# EAGLE design main (EAGLE 7.1.0)

## Sheet 1 of 2: Main
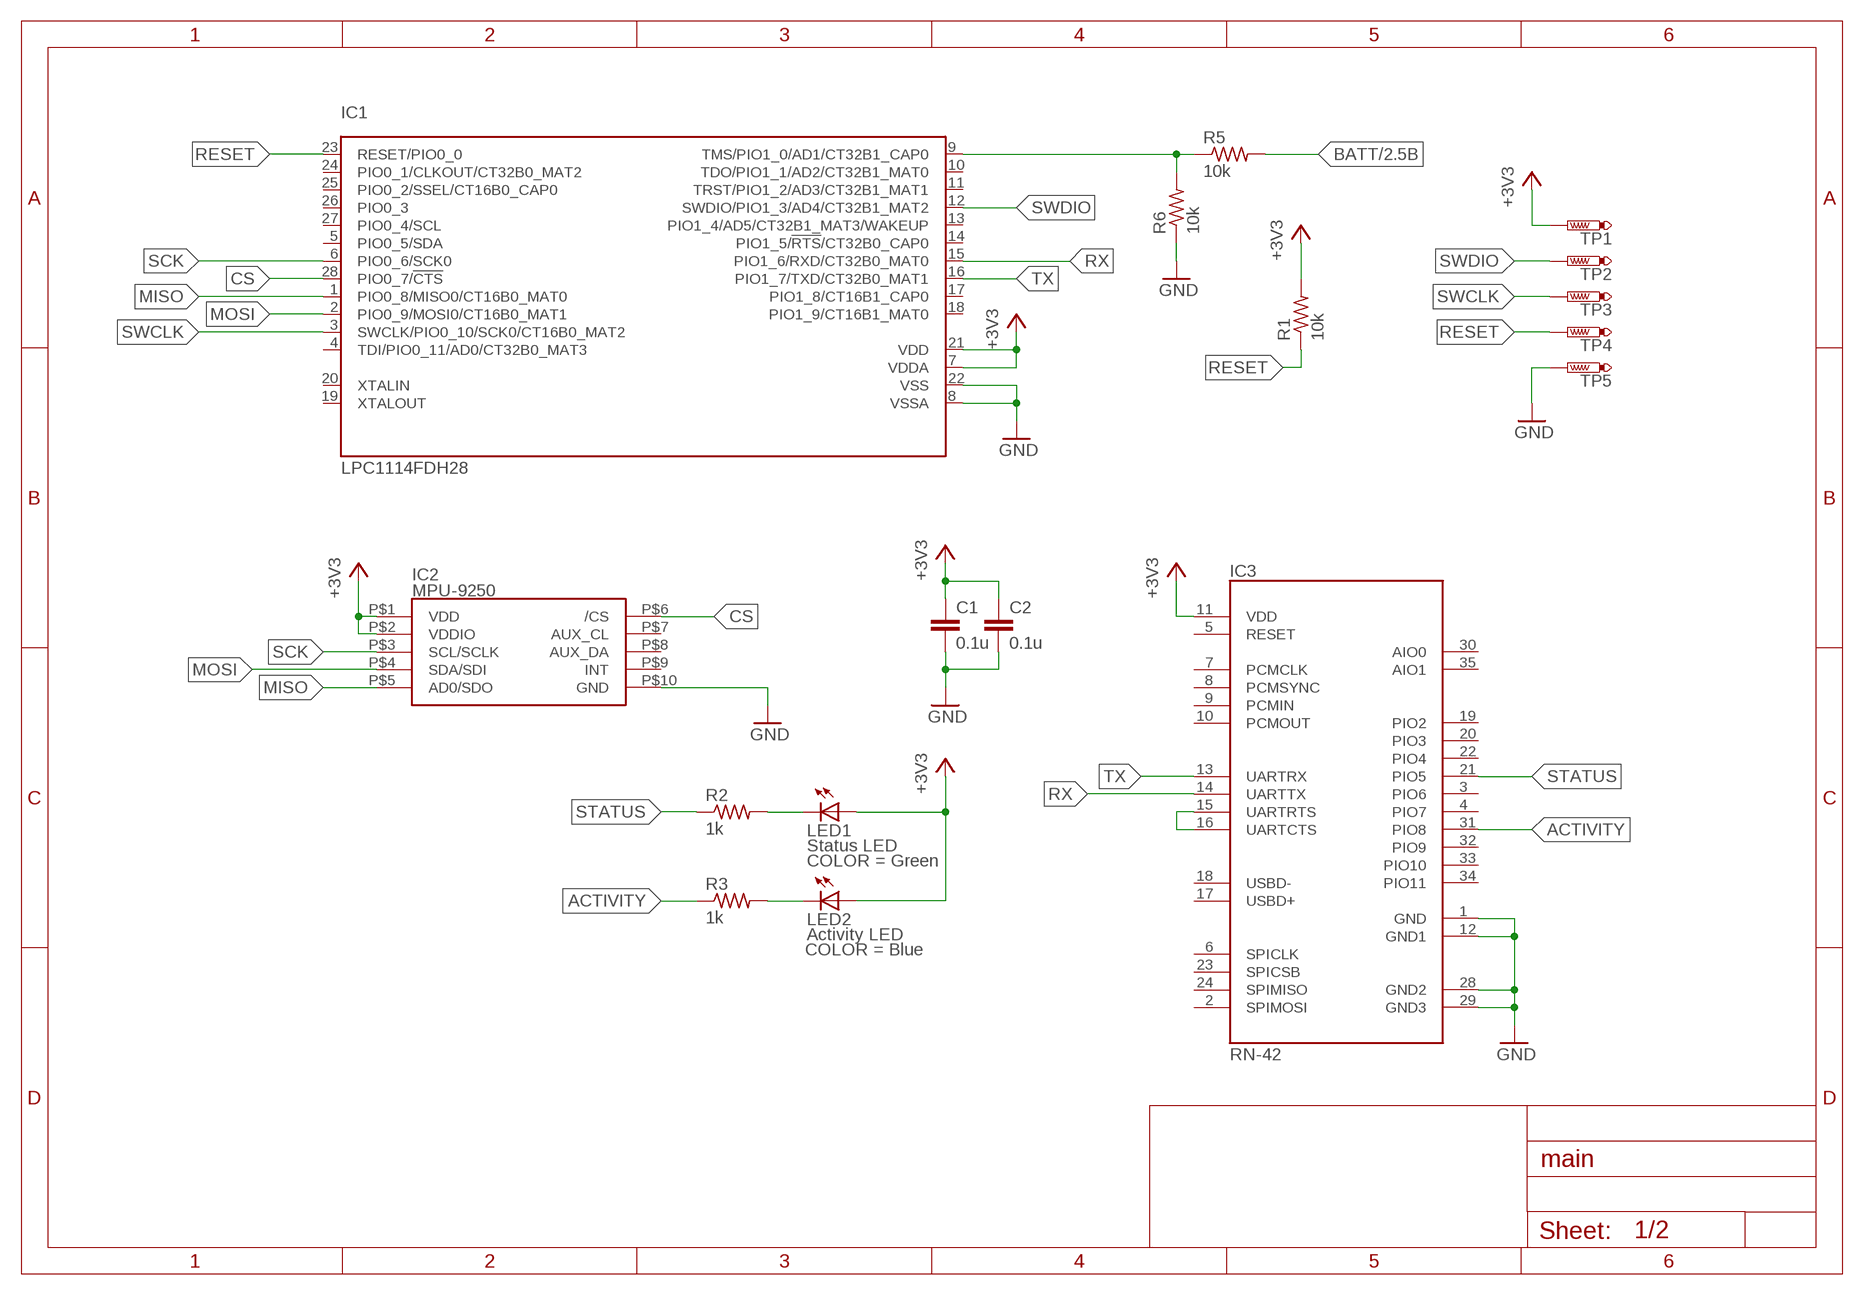
[diagram p0: schematic, sheet 1]

### Parts
C1  0.1u  C-EUC0603  [C0603]
C2  0.1u  C-EUC0603  [C0603]
IC1  LPC1114FDH28  [SOT361-1]
IC2  MPU-9250  [DIP10S]
IC3  RN-42  BLUETOOTH-RN41"  [RN41]
LED1  Status LED  LEDCHIP-LED0603  [CHIP-LED0603]
LED2  Activity LED  LEDCHIP-LED0603  [CHIP-LED0603]
R1  10k  R-US_R0603  [R0603]
R2  1k  R-US_R0603  [R0603]
R3  1k  R-US_R0603  [R0603]
R5  10k  R-US_R0603  [R0603]
R6  10k  R-US_R0603  [R0603]
TP1  3V3  PTR1B1,27  [B1,27]
TP2  SWDIO  PTR1B1,27  [B1,27]
TP3  SWCLK  PTR1B1,27  [B1,27]
TP4  RESET  PTR1B1,27  [B1,27]
TP5  GND  PTR1B1,27  [B1,27]

### Nets
+3V3: C1.1 C2.1 IC1.7(VDDA) IC1.21(VDD) IC2.P$1(VDD) IC2.P$2(VDDIO) IC3.11(VDD) LED1.A LED2.A R1.2 TP1.TP ; also sheet 2
ACTIVITY: IC3.31(PIO8) R3.1
BATT: R5.2 ; also sheet 2
CS: IC1.28(PIO0_7/!CTS!) IC2.P$6(/CS)
GND: C1.2 C2.2 IC1.8(VSSA) IC1.22(VSS) IC2.P$10(GND) IC3.1(GND) IC3.12(GND1) IC3.28(GND2) IC3.29(GND3) R6.1 TP5.TP ; also sheet 2
MISO: IC1.1(PIO0_8/MISO0/CT16B0_MAT0) IC2.P$5(AD0/SDO)
MOSI: IC1.2(PIO0_9/MOSI0/CT16B0_MAT1) IC2.P$4(SDA/SDI)
N$1: IC3.15(UARTRTS) IC3.16(UARTCTS)
N$3: LED1.C R2.2
N$4: LED2.C R3.2
N$8: IC1.9(TMS/PIO1_0/AD1/CT32B1_CAP0) R5.1 R6.2
RESET: IC1.23(RESET/PIO0_0) R1.1 TP4.TP
RX: IC1.15(PIO1_6/RXD/CT32B0_MAT0) IC3.14(UARTTX)
SCK: IC1.6(PIO0_6/SCK0) IC2.P$3(SCL/SCLK)
STATUS: IC3.21(PIO5) R2.1
SWCLK: IC1.3(SWCLK/PIO0_10/SCK0/CT16B0_MAT2) TP3.TP
SWDIO: IC1.12(SWDIO/PIO1_3/AD4/CT32B1_MAT2) TP2.TP
TX: IC1.16(PIO1_7/TXD/CT32B0_MAT1) IC3.13(UARTRX)
Unconnected: IC1.4(TDI/PIO0_11/AD0/CT32B0_MAT3) IC1.5(PIO0_5/SDA) IC1.10(TDO/PIO1_1/AD2/CT32B1_MAT0) IC1.11(TRST/PIO1_2/AD3/CT32B1_MAT1) IC1.13(PIO1_4/AD5/CT32B1_MAT3/WAKEUP) IC1.14(PIO1_5/!RTS!/CT32B0_CAP0) IC1.17(PIO1_8/CT16B1_CAP0) IC1.18(PIO1_9/CT16B1_MAT0) IC1.19(XTALOUT) IC1.20(XTALIN) IC1.24(PIO0_1/CLKOUT/CT32B0_MAT2) IC1.25(PIO0_2/SSEL/CT16B0_CAP0) IC1.26(PIO0_3) IC1.27(PIO0_4/SCL) IC2.P$7(AUX_CL) IC2.P$8(AUX_DA) IC2.P$9(INT) IC3.2(SPIMOSI) IC3.3(PIO6) IC3.4(PIO7) IC3.5(RESET) IC3.6(SPICLK) IC3.7(PCMCLK) IC3.8(PCMSYNC) IC3.9(PCMIN) IC3.10(PCMOUT) IC3.17(USBD+) IC3.18(USBD-) IC3.19(PIO2) IC3.20(PIO3) IC3.22(PIO4) IC3.23(SPICSB) IC3.24(SPIMISO) IC3.30(AIO0) IC3.32(PIO9) IC3.33(PIO10) IC3.34(PIO11) IC3.35(AIO1)

## Sheet 2 of 2: Power
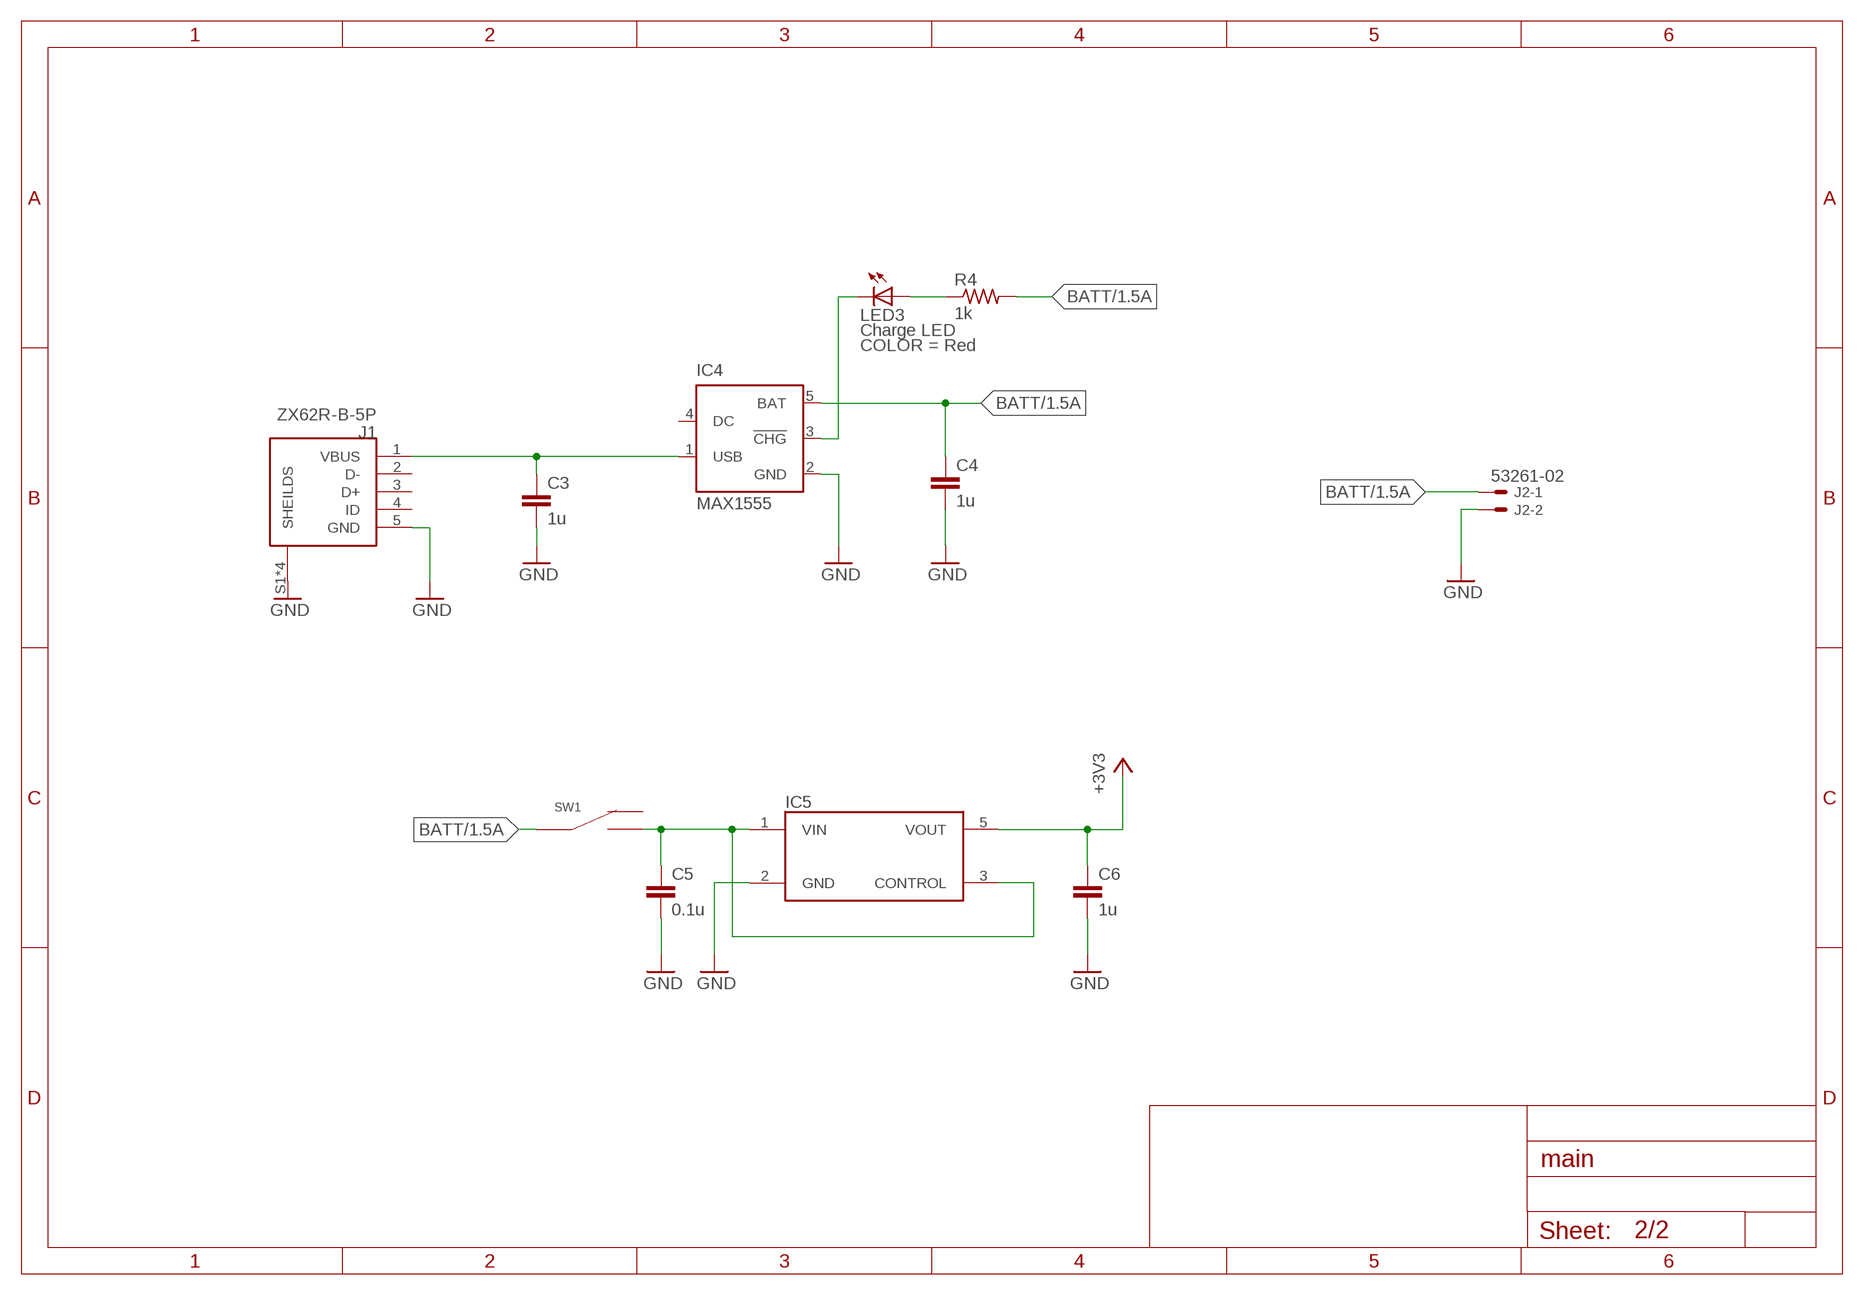
[diagram p1: schematic, sheet 2]

### Parts
C3  1u  C-EUC0603  [C0603]
C4  1u  C-EUC0603  [C0603]
C5  0.1u  C-EUC0603  [C0603]
C6  1u  C-EUC0603  [C0603]
IC4  MAX1555  [SOT23-5L]
IC5  NJM2866F33  [SOT23-5L]
J1  ZX62R-B-5P  [ZX62R-B-5P]
J2  53261-02  [53261-02]
LED3  Charge LED  LEDCHIP-LED0603  [CHIP-LED0603]
R4  1k  R-US_R0603  [R0603]
SW1  SK-12D01-VG4  [SK-12D01-VG4]

### Nets
+3V3: C6.1 IC5.5(VOUT) ; also sheet 1
BATT: C4.1 IC4.5(BAT) J2.1 R4.2 SW1.P$2 ; also sheet 1
GND: C3.2 C4.2 C5.2 C6.2 IC4.2(GND) IC5.2(GND) J1.5(GND) J1.S1(SHEILDS) J1.S2(SHEILDS) J1.S3(SHEILDS) J1.S4(SHEILDS) J2.2 ; also sheet 1
N$2: C3.1 IC4.1(USB) J1.1(VBUS)
N$5: IC4.3(!CHG) LED3.C
N$6: LED3.A R4.1
N$7: C5.1 IC5.1(VIN) IC5.3(CONTROL) SW1.P$3
Unconnected: IC4.4(DC) J1.2(D-) J1.3(D+) J1.4(ID) SW1.P$1

## Library data of the parts
C1-C6 = rcl:C-EU: CAPACITOR, European symbol
IC1 = nxp_60:LPC1114FDH28: LPC1114 50 MHz 32-bit ARM Cortex-M0 based microcontroller featuring a high level of integration and very low power consumption. On-chip flash program memory The LPC1110/11/12/13/14 contain 32 kB (LPC1114), 24 kB (LPC1113), 16 kB (LPC1112), 8 kB (LPC1111),or 4 kB (LPC1110) of on-chip flash memory. On-chip SRAM The LPC1110/11/12/13/14 contain a total of 8 kB, 4 kB, 2 kB, or 1 kB on-chip static RAM memory. MK - Datasheet available on www.nxp.com; MF: NXP Semiconductors; MPN: LPC1114FDH28/102; OC: I-10224; SITE: Akizukidenshi
IC2 = Library:MPU-9250; MF: InverSense; MPN: MPU-9250; OC: 12250; SITE: StrawberryLinux
IC3 = SparkFun-RF:BLUETOOTH-RN41: Bluetooth SMD module; MF: Microchip; MPN: RN-42-I/RM; OC: M-07612; SITE: Akizukidenshi
IC4 = maxim:MAX1555: Dual-Input USB/AC Adapter 1-Cell Li+ Battery Chargers Source: http://www.maxim-ic.com .. MAX1551-MAX1555.pdf; MF: MAXIM; MPN: MAX1555EZK+T; OC_FARNELL: 1628222; OC_NEWARK: 59J2761
IC5 = Library:NJM2866F33; MF: NewJRC; MPN: NJM2866F33; OC: I-05448; SITE: Akizukidenshi
J1 = Library:ZX62R-B-5P; MF: Hirose; MPN: ZX62R-B-5P; OC: C-05254; SITE: Akizukidenshi
J2 = con-molex:53?-02: CONNECTOR wire to board 1.25 mm (.049 inch) pitch header; MF: Molex; MPN: 53261-0271; OC: 542-7090; OC_FARNELL: 1125373; OC_NEWARK: unknown; SITE: RS Components
LED1 = led:LED: LED OSRAM: - CHIPLED LG R971, LG N971, LY N971, LG Q971, LY Q971, LO R971, LY R971 LH N974, LH R974 LS Q976, LO Q976, LY Q976 LO Q996 - Hyper CHIPLED LW Q18S LB Q993, LB Q99A, LB R99A - SideLED LS A670, LO A670, LY A670, LG A670, LP A670 LB A673, LV A673, LT A673, LW A673 LH A674 LY A675 LS A676, LA A676, LO A676, LY A676, LW A676 LS A679, LY A679, LG A679 - Hyper Micro SIDELED® LS Y876, LA Y876, LO Y876, LY Y876 LT Y87S - SmartLED LW L88C, LW L88S LB L89C, LB L89S, LG L890 LS L89K, LO L89K, LY L89K LS L896, LA L896, LO L896, LY L896 - TOPLED LS T670, LO T670, LY T670, LG T670, LP T670 LSG T670, LSP T670, LSY T670, LOP T670, LYG T670 LG T671, LOG T671, LSG T671 LB T673, LV T673, LT T673, LW T673 LH T674 LS T676, LA T676, LO T676, LY T676, LB T676, LH T676, LSB T676, LW T676 LB T67C, LV T67C, LT T67C, LS T67K, LO T67K, LY T67K, LW E67C LS E67B, LA E67B, LO E67B, LY E67B, LB E67C, LV E67C, LT E67C LW T67C LS T679, LY T679, LG T679 LS T770, LO T770, LY T770, LG T770, LP T770 LB T773, LV T773, LT T773, LW T773 LH T774 LS E675, LA E675, LY E675, LS T675 LS T776, LA T776, LO T776, LY T776, LB T776 LHGB T686 LT T68C, LB T68C - Hyper Mini TOPLED® LB M676 - Mini TOPLED Santana® LG M470 LS M47K, LO M47K, LY M47K Source: http://www.osram.convergy.de LUXEON: - LUMILED® LXK2-PW12-R00, LXK2-PW12-S00, LXK2-PW14-U00, LXK2-PW14-V00 LXK2-PM12-R00, LXK2-PM12-S00, LXK2-PM14-U00 LXK2-PE12-Q00, LXK2-PE12-R00, LXK2-PE12-S00, LXK2-PE14-T00, LXK2-PE14-U00 LXK2-PB12-K00, LXK2-PB12-L00, LXK2-PB12-M00, LXK2-PB14-N00, LXK2-PB14-P00, LXK2-PB14-Q00 LXK2-PR12-L00, LXK2-PR12-M00, LXK2-PR14-Q00, LXK2-PR14-R00 LXK2-PD12-Q00, LXK2-PD12-R00, LXK2-PD12-S00 LXK2-PH12-R00, LXK2-PH12-S00 LXK2-PL12-P00, LXK2-PL12-Q00, LXK2-PL12-R00 Source: www.luxeon.com KINGBRIGHT: KA-3528ASYC Source: www.kingbright.com; COLOR: Green; MF: OptoSupply; MPN: OSYG1608C1A; OC: I-03980; SITE: Akizukidenshi
LED2 = led:LED: LED OSRAM: - CHIPLED LG R971, LG N971, LY N971, LG Q971, LY Q971, LO R971, LY R971 LH N974, LH R974 LS Q976, LO Q976, LY Q976 LO Q996 - Hyper CHIPLED LW Q18S LB Q993, LB Q99A, LB R99A - SideLED LS A670, LO A670, LY A670, LG A670, LP A670 LB A673, LV A673, LT A673, LW A673 LH A674 LY A675 LS A676, LA A676, LO A676, LY A676, LW A676 LS A679, LY A679, LG A679 - Hyper Micro SIDELED® LS Y876, LA Y876, LO Y876, LY Y876 LT Y87S - SmartLED LW L88C, LW L88S LB L89C, LB L89S, LG L890 LS L89K, LO L89K, LY L89K LS L896, LA L896, LO L896, LY L896 - TOPLED LS T670, LO T670, LY T670, LG T670, LP T670 LSG T670, LSP T670, LSY T670, LOP T670, LYG T670 LG T671, LOG T671, LSG T671 LB T673, LV T673, LT T673, LW T673 LH T674 LS T676, LA T676, LO T676, LY T676, LB T676, LH T676, LSB T676, LW T676 LB T67C, LV T67C, LT T67C, LS T67K, LO T67K, LY T67K, LW E67C LS E67B, LA E67B, LO E67B, LY E67B, LB E67C, LV E67C, LT E67C LW T67C LS T679, LY T679, LG T679 LS T770, LO T770, LY T770, LG T770, LP T770 LB T773, LV T773, LT T773, LW T773 LH T774 LS E675, LA E675, LY E675, LS T675 LS T776, LA T776, LO T776, LY T776, LB T776 LHGB T686 LT T68C, LB T68C - Hyper Mini TOPLED® LB M676 - Mini TOPLED Santana® LG M470 LS M47K, LO M47K, LY M47K Source: http://www.osram.convergy.de LUXEON: - LUMILED® LXK2-PW12-R00, LXK2-PW12-S00, LXK2-PW14-U00, LXK2-PW14-V00 LXK2-PM12-R00, LXK2-PM12-S00, LXK2-PM14-U00 LXK2-PE12-Q00, LXK2-PE12-R00, LXK2-PE12-S00, LXK2-PE14-T00, LXK2-PE14-U00 LXK2-PB12-K00, LXK2-PB12-L00, LXK2-PB12-M00, LXK2-PB14-N00, LXK2-PB14-P00, LXK2-PB14-Q00 LXK2-PR12-L00, LXK2-PR12-M00, LXK2-PR14-Q00, LXK2-PR14-R00 LXK2-PD12-Q00, LXK2-PD12-R00, LXK2-PD12-S00 LXK2-PH12-R00, LXK2-PH12-S00 LXK2-PL12-P00, LXK2-PL12-Q00, LXK2-PL12-R00 Source: www.luxeon.com KINGBRIGHT: KA-3528ASYC Source: www.kingbright.com; COLOR: Blue; MF: OptoSupply; MPN: OSBL1608C1A; OC: I-03982; SITE: Akizukidenshi
LED3 = led:LED: LED OSRAM: - CHIPLED LG R971, LG N971, LY N971, LG Q971, LY Q971, LO R971, LY R971 LH N974, LH R974 LS Q976, LO Q976, LY Q976 LO Q996 - Hyper CHIPLED LW Q18S LB Q993, LB Q99A, LB R99A - SideLED LS A670, LO A670, LY A670, LG A670, LP A670 LB A673, LV A673, LT A673, LW A673 LH A674 LY A675 LS A676, LA A676, LO A676, LY A676, LW A676 LS A679, LY A679, LG A679 - Hyper Micro SIDELED® LS Y876, LA Y876, LO Y876, LY Y876 LT Y87S - SmartLED LW L88C, LW L88S LB L89C, LB L89S, LG L890 LS L89K, LO L89K, LY L89K LS L896, LA L896, LO L896, LY L896 - TOPLED LS T670, LO T670, LY T670, LG T670, LP T670 LSG T670, LSP T670, LSY T670, LOP T670, LYG T670 LG T671, LOG T671, LSG T671 LB T673, LV T673, LT T673, LW T673 LH T674 LS T676, LA T676, LO T676, LY T676, LB T676, LH T676, LSB T676, LW T676 LB T67C, LV T67C, LT T67C, LS T67K, LO T67K, LY T67K, LW E67C LS E67B, LA E67B, LO E67B, LY E67B, LB E67C, LV E67C, LT E67C LW T67C LS T679, LY T679, LG T679 LS T770, LO T770, LY T770, LG T770, LP T770 LB T773, LV T773, LT T773, LW T773 LH T774 LS E675, LA E675, LY E675, LS T675 LS T776, LA T776, LO T776, LY T776, LB T776 LHGB T686 LT T68C, LB T68C - Hyper Mini TOPLED® LB M676 - Mini TOPLED Santana® LG M470 LS M47K, LO M47K, LY M47K Source: http://www.osram.convergy.de LUXEON: - LUMILED® LXK2-PW12-R00, LXK2-PW12-S00, LXK2-PW14-U00, LXK2-PW14-V00 LXK2-PM12-R00, LXK2-PM12-S00, LXK2-PM14-U00 LXK2-PE12-Q00, LXK2-PE12-R00, LXK2-PE12-S00, LXK2-PE14-T00, LXK2-PE14-U00 LXK2-PB12-K00, LXK2-PB12-L00, LXK2-PB12-M00, LXK2-PB14-N00, LXK2-PB14-P00, LXK2-PB14-Q00 LXK2-PR12-L00, LXK2-PR12-M00, LXK2-PR14-Q00, LXK2-PR14-R00 LXK2-PD12-Q00, LXK2-PD12-R00, LXK2-PD12-S00 LXK2-PH12-R00, LXK2-PH12-S00 LXK2-PL12-P00, LXK2-PL12-Q00, LXK2-PL12-R00 Source: www.luxeon.com KINGBRIGHT: KA-3528ASYC Source: www.kingbright.com; COLOR: Red; MF: OptoSupply; MPN: OSHR1608C1A; OC: I-03978; SITE: Akizukidenshi
R1-R6 = rcl:R-US_: RESISTOR, American symbol
SW1 = Library:SK-12D01-VG4; MF: Zhejiang Jianfu; MPN: SK-12D01-VG4; OC: P-08789; SITE: Akizukidenshi
TP1-TP5 = testpad:PTR1: TEST PIN

## Net classes
0 default: width 0.254 mm

## Board
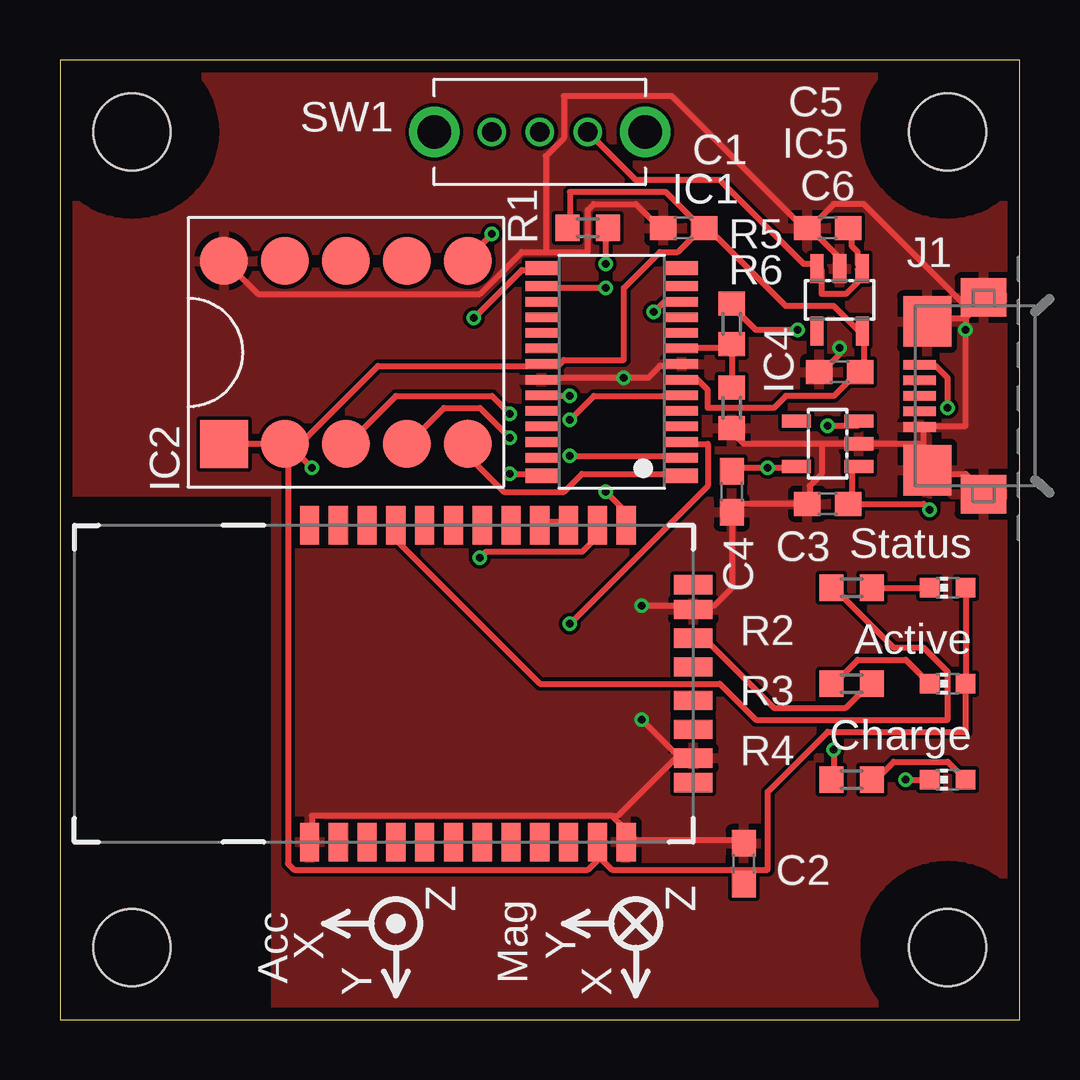
[diagram p2: board, top side]
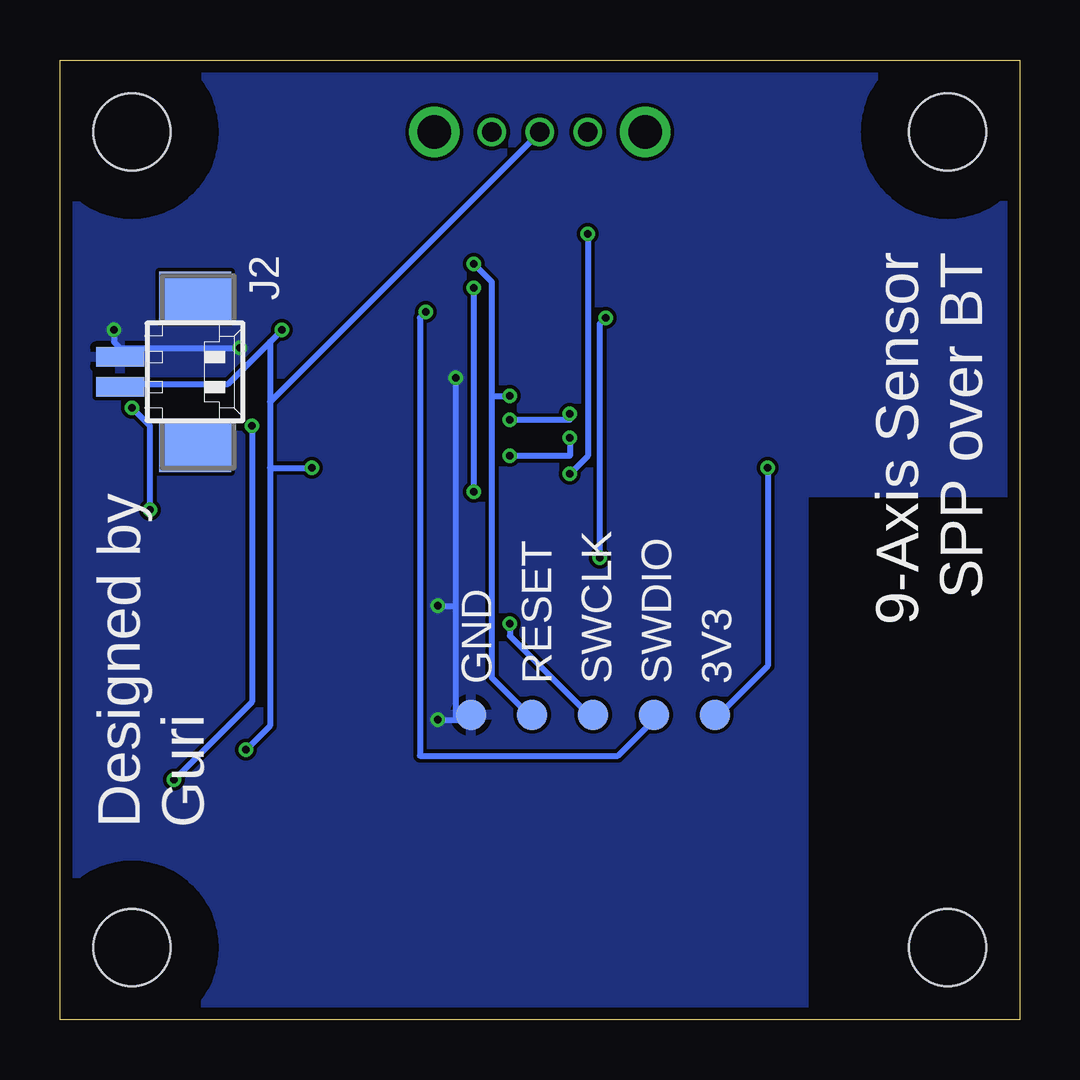
[diagram p3: board, bottom side, seen from below]

Size 40 x 40 mm. Coordinates in mm from the lower left corner, seen from the top.
Outline: 0,0 40,0 40,40 0,40 0,0
Copper layers (1*16): Top 0.035mm / dielectric 1.6mm / Bottom 0.035mm
Design rules "Elecrow_2-layer_PCB_eagle_rule": minimum track width 6mil, minimum drill 12mil, track to track 6mil, track to pad 6mil, pad to pad 6mil, via to via 8mil, smd to smd 0mil, copper to edge 20mil, drill to drill 10mil, minimum pad ring 6mil, minimum via ring 6mil, stop-mask expansion 0mil, vias tented up to drill 100mil, thermal gap 10mil
Holes 3.2 mm at 3,37 37,37 37,3 3,3
tRestrict: area -0.5,33.5 to 6.5,40.5; area 33.5,-0.5 to 40.5,6.5; area 33.5,33.5 to 40.5,40.5; area -0.5,-0.5 to 6.5,6.5
bRestrict: area 33.5,33.5 to 40.5,40.5; area -0.5,-0.5 to 6.5,6.5; area -0.5,33.5 to 6.5,40.5; area 33.5,-0.5 to 40.5,6.5

### Footprints (pad centres in the part's own frame; a part is rotated, then mirrored left to right if it is on the bottom)
C0603 = smd 1.1 x 1: 1 -0.85,0; 2 0.85,0
SOT361-1 = smd 0.6 x 1.35: 1 -4.325,-2.925; 14 4.325,-2.925; 15 4.325,2.925; 28 -4.325,2.925 | smd 0.4 x 1.35: 2 -3.575,-2.925; 3 -2.925,-2.925; 4 -2.275,-2.925; 5 -1.625,-2.925; 6 -0.975,-2.925; 7 -0.325,-2.925; 8 0.325,-2.925; 9 0.975,-2.925; 10 1.625,-2.925; 11 2.275,-2.925; 12 2.925,-2.925; 13 3.575,-2.925; 16 3.575,2.925; 17 2.925,2.925; 18 2.275,2.925; 19 1.625,2.925; 20 0.975,2.925; 21 0.325,2.925; 22 -0.325,2.925; 23 -0.975,2.925; 24 -1.625,2.925; 25 -2.275,2.925; 26 -2.925,2.925; 27 -3.575,2.925
DIP10S = smd 2 x 2: P$1 0,10.16; P$2 0,7.62; P$3 0,5.08; P$4 0,2.54; P$5 0,0; P$6 7.62,0; P$7 7.62,2.54; P$8 7.62,5.08; P$9 7.62,7.62; P$10 7.62,10.16
RN41 = smd 0.8 x 1.6: 1 -6.6,-6.6; 2 -5.4,-6.6; 3 -4.2,-6.6; 4 -3,-6.6; 5 -1.8,-6.6; 6 -0.6,-6.6; 7 0.6,-6.6; 8 1.8,-6.6; 9 3,-6.6; 10 4.2,-6.6; 11 5.4,-6.6; 12 6.6,-6.6; 13 6.6,6.6; 14 5.4,6.6; 15 4.2,6.6; 16 3,6.6; 17 1.8,6.6; 18 0.6,6.6; 19 -0.6,6.6; 20 -1.8,6.6; 21 -3,6.6; 22 -4.2,6.6; 23 -5.4,6.6; 24 -6.6,6.6 | smd 1.6 x 0.8: 28 9.4,3.1; 29 9.4,-3.1; 30 9.4,4.122; 31 9.4,1.9; 32 9.4,0.7; 33 9.4,-0.7; 34 9.4,-1.9; 35 9.4,-4.122
SOT23-5L = smd 0.55 x 1.2: 1 -0.95,-1.3; 2 0,-1.3; 3 0.95,-1.3; 4 0.95,1.3; 5 -0.95,1.3
ZX62R-B-5P = smd 0.4 x 1.35: 1 1.3,2.675; 2 0.65,2.675; 3 0,2.675; 4 -0.65,2.675; 5 -1.3,2.675 | smd 1.6 x 1.9: S1 4.1,0; S2 -4.1,0 | smd 2.1 x 2: S3 3.1,2.35; S4 -3.1,2.35
53261-02 = smd 0.8 x 2: 1 0.625,-2.5; 2 -0.625,-2.5 | smd 2.1 x 3: S1 3.125,0.625; S2 -3.125,0.625
CHIP-LED0603 = smd 0.8 x 0.8: A 0,-0.75; C 0,0.75
R0603 = smd 1 x 1.1: 1 -0.85,0; 2 0.85,0
SK-12D01-VG4 = drill 0.8: P$1 0,0; P$2 2,0; P$3 4,0 | drill 1.4: P$4 -2.4,0; P$5 6.4,0
B1,27 = smd 1.27 x 1.27: TP 0,0

### Placement (x,y rotation side)
C1  26,33 180 top
C2  28.5,6.5 90 top
C3  32,21.5 180 top
C4  28,22 270 top
C5  32,33 180 top
C6  32.5,27 180 top
IC1  23,27 90 top
IC2  17,24 90 top
IC3  17,14 0 top
IC4  32,24 90 top
IC5  32.5,30 180 top
J1  38.5,26 90 top
J2  35,27 270 bottom
LED1  37,18 90 top
LED2  37,14 90 top
LED3  37,10 90 top
R1  22,33 180 top
R2  33,18 0 top
R3  33,14 180 top
R4  33,10 180 top
R5  28,29 90 top
R6  28,25.5 90 top
SW1  18,37 0 top
TP1  12.7,12.7 0 bottom
TP2  15.24,12.7 0 bottom
TP3  17.78,12.7 0 bottom
TP4  20.32,12.7 0 bottom
TP5  22.86,12.7 0 bottom

### Tracks (layer width: path | path; a pad name or v marks a point on that pad's centre or on a via)
+3V3  (via drill 0.3)
  Top 0.254: LED1.A LED2.A 37.75,12 32,12 29.5,9.5 29.5,6.25 28,6.25 | 28,6.25 28.5,5.75 C2.1 | 28,6.25 23,6.25 22.5,6.75 | 22.5,6.75 22.5,7.25 IC3.11 22.5,6.75 | 26.75,33 25.25,34.5 21.25,34.5 21.25,33 R1.2 | IC1.7 26,26.75 26.5,26.75 27,26.25 27,25.5 29.75,25.5 30.25,26 32.25,26 33.25,27 C6.1 33.5,27 33.5,28.5 IC5.5 33.25,28.75 32.25,29.75 30.25,29.75 27,33 C1.1 26.75,33 | 9.5,24 9.75,23.75 | 9.75,23.75 v10.5,23 | 9.75,23.75 13.25,27.25 20,27.25 IC1.21 20.25,27.25 20.75,27.25 21,27.5 23.5,27.5 23.5,30.5 25,32 25.75,32 26.75,33 | 9.75,23.75 IC2.P$2 | IC2.P$2 IC2.P$1 | 22.5,6.75 22,6.25 9.75,6.25 9.5,6.5 9.5,24 | 9.5,24 IC2.P$2
  Bottom 0.254: v10.5,23 10.5,14.75 12.5,12.75 TP1.TP
ACTIVITY
  Top 0.254: R3.1 33.75,14 32.75,13 29.75,13 27,15.75 26.5,15.75 IC3.31
BATT  (via drill 0.3)
  Top 0.254: C4.1 28,23 v29.5,23 30.5,23 IC4.5 | v30.75,28.75 29,28.75 28,29.75 R5.2 | v32.25,11.25 32.25,10 R4.2
  Bottom 0.254: 31.25,28.25 33,26.5 37.5,26.5 J2.1 | 31.25,28.25 v30.75,28.75 | v32.25,11.25 31.25,12.25 31.25,23 | 31.25,28.25 31.25,25.75 | 31.25,25.75 31.25,23 | 31.25,23 v29.5,23 | 31.25,25.75 SW1.P$2
CS  (via drill 0.3)
  Top 0.254: v18.75,22.75 20,22.75 IC1.28 | v18,32.75 17,31.75 IC2.P$6
  Bottom 0.254: v18.75,22.75 18,23.5 v18,32.75
GND  (via drill 0.3)
  Top 0.254: IC1.22 20.25,26.75 v23.5,26.75 24.5,26.75 25,27.25 25.75,27.25 IC1.8 | 25.75,11 v24.25,12.5 | 25.75,11 26.25,11 IC3.29 25.75,11 | 24,7.5 23.75,7.5 IC3.12 | 24,7.5 28.5,7.5 C2.2 | 23,8.5 10.5,8.5 10.5,7.5 IC3.1 | 24,7.5 23,8.5 | 25.75,11 23.25,8.5 23,8.5 | 20.25,32 19.25,32 17.5,30.25 8.25,30.25 7,31.5 IC2.P$10 | 20.25,32 22,32 22,33.75 22.25,34 24,34 25,33 C1.2 | v32.5,28 32.5,27.75 31.75,27 C6.2 | 31.25,33 32.5,31.75 IC5.2 | 37.75,29.25 38,29.5 | 38,29.5 38.5,30 J1.S1 38,29.5 | 37.75,29.25 36.25,29.25 J1.S3 | 31.25,33 32.25,34 33.5,34 38,29.5 | 31.25,33 C5.2 31,33 25.5,38.5 21,38.5 21,36.75 20.25,36 20.25,32 | 37.75,29.25 v37.75,28.75 37.75,24.75 36,24.75 | 31.75,24 IC4.2 36,24 | 31.75,24 28.5,24 28,24.5 R6.1 | 36,24 36,23 J1.S4 36.25,22.75 37.75,22.75 38.5,22 J1.S2 | 36,24 36,24.75 | 31.75,24 31.75,22.75 31.25,22.25 31.25,21.5 C3.2 28.25,21.5 28,21.25 C4.2 28,18 27.25,17.25 26.5,17.25 IC3.28 26.25,17.25 v24.25,17.25 | 36,24.75 J1.5
  Bottom 0.254: v24.25,12.5 23.5,12.5 | 23.5,12.5 23,12.5 TP5.TP | 23.5,12.5 23.5,17.25 | 23.5,17.25 v23.5,26.75 | 37.5,28 v32.5,28 | 37.5,28 37.75,28.25 v37.75,28.75 | 37.5,28 J2.2 | v24.25,17.25 23.5,17.25
  pour Top: -3,43 43,43 43,-3 9,-3 9,22 -3,22
  pour Bottom: -2,42 42,42 42,-2 9,-2 9,22 -2,22
MISO
  Top 0.254: IC2.P$5 17,23.5 18.5,22 21,22 21.75,22.75 25.75,22.75 IC1.1
MOSI  (via drill 0.3)
  Top 0.254: v21.25,23.5 25.75,23.5 IC1.2 | v18.75,24.25 17.5,25.5 16,25.5 14.5,24 IC2.P$4
  Bottom 0.254: v21.25,23.5 18.75,23.5 v18.75,24.25
N$1
  Top 0.254: IC3.16 20,20.75 21,20.75 IC3.15
N$2  (via drill 0.3)
  Top 0.254: 33,21.5 33,23 33.25,23 IC4.1 | v37,25.5 37,26.75 36.5,27.25 36,27.25 J1.1 | v36.25,21.25 36,21.5 33,21.5 | 33,21.5 C3.1
  Bottom 0.254: v37,25.5 36.25,24.75 v36.25,21.25
N$3
  Top 0.254: R2.2 LED1.C
N$4
  Top 0.254: LED2.C 35.25,15 33.25,15 32.25,14 R3.2
N$5  (via drill 0.3)
  Top 0.254: v35.25,10 LED3.C | v32,24.75 33.25,24.75 IC4.3
  Bottom 0.254: v35.25,10 32,13.25 v32,24.75
N$6
  Top 0.254: LED3.A 37,10.75 34.75,10.75 34,10 R4.1
N$7
  Top 0.254: C5.1 33,33 33,32.25 33.25,32 33.25,31.5 IC5.1 33.25,31.25 33.25,30.75 32.75,30.25 31.75,30.25 31.75,31.25 IC5.3 31.5,31.5 31,31.5 27.5,35 24,35 SW1.P$3
N$8
  Top 0.254: 28,28 R6.2 | 28,28 26,28 IC1.9 | 28,28 R5.1
RESET  (via drill 0.3)
  Top 0.254: v22.75,31.5 22.75,33 R1.1 | v21.25,26 20.25,26 IC1.23
  Bottom 0.254: v22.75,31.5 22,30.75 22,26 | 22,26 22,14.25 20.5,12.75 TP4.TP | 22,26 v21.25,26
RX  (via drill 0.3)
  Top 0.254: v17.25,29.25 19.25,31.25 20,31.25 IC1.15 | v17.5,19.25 17.75,19.5 21.75,19.5 22.25,20 22.25,20.5 IC3.14
  Bottom 0.254: v17.25,29.25 17.5,29 v17.5,19.25
SCK  (via drill 0.3)
  Top 0.254: v21.25,25 22.25,26 25.75,26 IC1.6 | v18.75,25.25 18,26 14,26 12,24 IC2.P$3
  Bottom 0.254: v21.25,25 18.75,25 v18.75,25.25
STATUS
  Top 0.254: IC3.21 14,20 20,14 27.5,14 29,12.5 37,12.5 37,14.5 36,15.5 34.75,15.5 32.25,18 R2.1
SWCLK  (via drill 0.3)
  Top 0.254: v21.25,16.5 27,22.25 27,24 26,24 IC1.3
  Bottom 0.254: v21.25,16.5 21.25,16 18,12.75 TP3.TP
SWDIO  (via drill 0.3)
  Top 0.254: v24.75,29.5 25.25,30 25.75,30 IC1.12
  Bottom 0.254: v24.75,29.5 25,29.25 25,11 16.75,11 15.25,12.5 TP2.TP
TX  (via drill 0.3)
  Top 0.254: v22.75,30.5 20.25,30.5 IC1.16 | v22.75,22 23.5,21.25 23.5,20.75 IC3.13
  Bottom 0.254: v22.75,22 v22.75,30.5

### Text on the board
tPlace: Status | Active | Charge | Z | Z | Acc | X | Mag | Y | Y | X
bPlace: 9-Axis Sensor / SPP over BT | 3V3 | SWDIO | SWCLK | RESET | GND | Designed by / Guri